# EAGLE design SK3000v5 LOGO+VIAS (EAGLE 7.2.0)
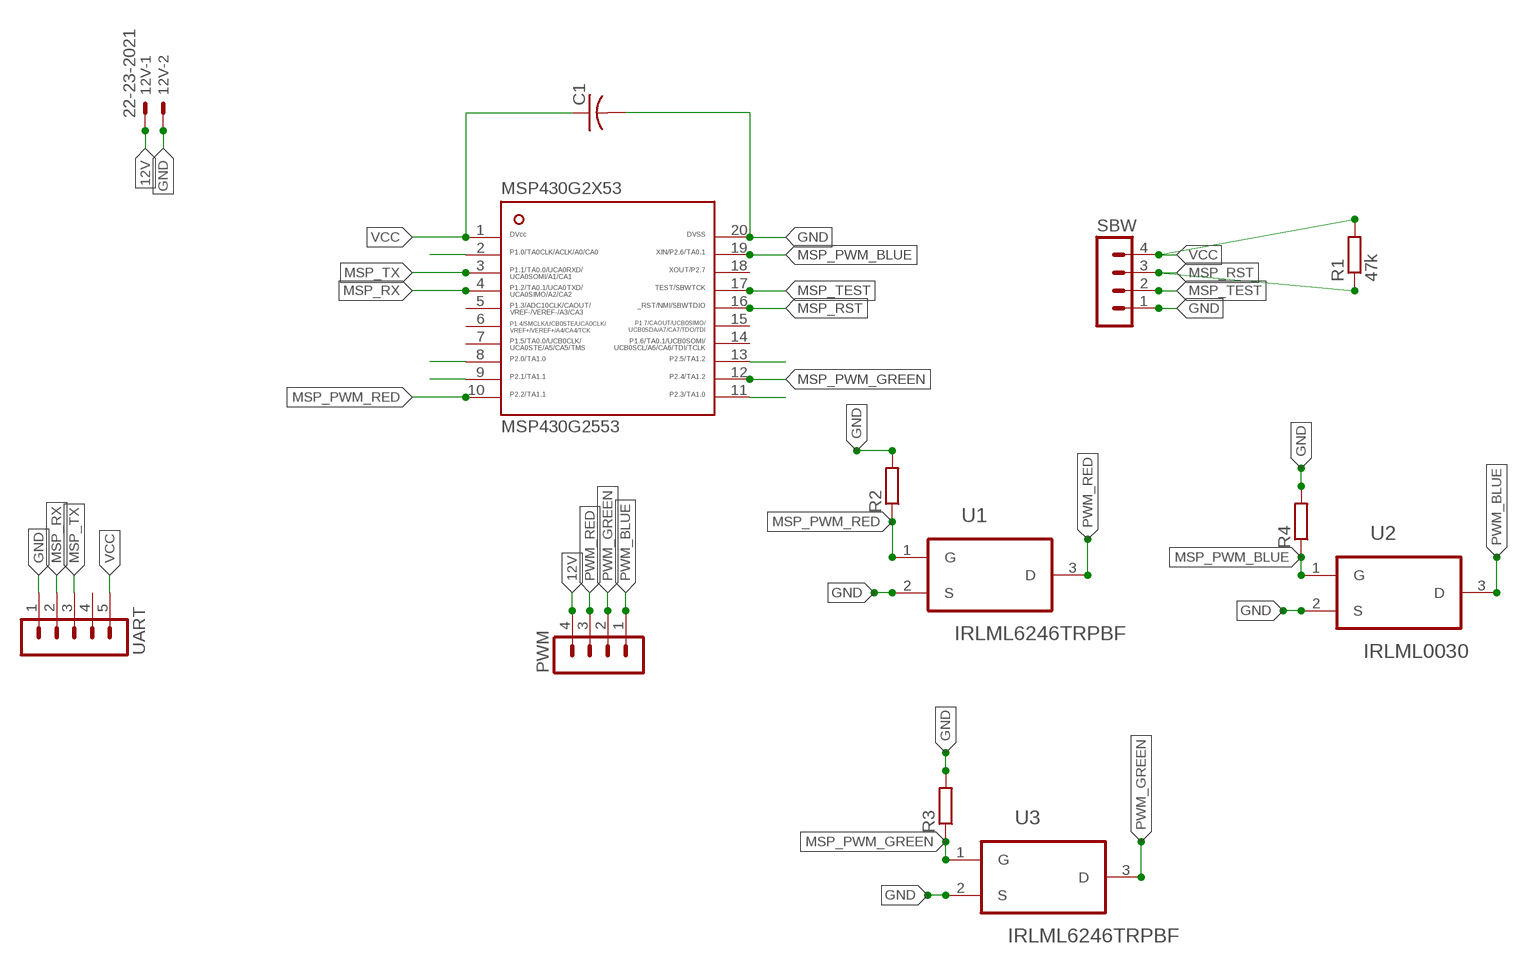
[diagram p0: schematic, sheet 1]

## Parts
12V  22-23-2021  [22-23-2021]
C1  C-USC0603  [C0603]
MSP430G2553  MSP430G2X53-20PW20  [PW20]
PWM  MA04-1  [MA04-1]
R1  47k  R-EU_R0603  [R0603]
R2  R-EU_R0603  [R0603]
R3  R-EU_R0603  [R0603]
R4  R-EU_R0603  [R0603]
SBW  MA04-1  [MA04-1]
U1  IRLML6246TRPBF  [SOT95P240X112-3N]
U2  IRLML0030  IRLML6246TRPBF  [SOT95P240X112-3N]
U3  IRLML6246TRPBF  [SOT95P240X112-3N]
UART  MA05-1  [MA05-1]

## Nets
12V: 12V.1 PWM.4
GND: 12V.2 C1.2 MSP430G2553.20 R2.2 R3.2 R4.2 SBW.1 U1.2(S) U2.2(S) U3.2(S) UART.1
MSP_PWM_BLUE: MSP430G2553.19 R4.1 U2.1(G)
MSP_PWM_GREEN: MSP430G2553.12 R3.1 U3.1(G)
MSP_PWM_RED: MSP430G2553.10 R2.1 U1.1(G)
MSP_RST: MSP430G2553.16 R1.1 SBW.3
MSP_RX: MSP430G2553.4 UART.2
MSP_TEST: MSP430G2553.17 SBW.2
MSP_TX: MSP430G2553.3 UART.3
N$32: MSP430G2553.2
N$33: MSP430G2553.8
N$34: MSP430G2553.9
N$36: MSP430G2553.13
N$37: MSP430G2553.11
PWM_BLUE: PWM.1 U2.3(D)
PWM_GREEN: PWM.2 U3.3(D)
PWM_RED: PWM.3 U1.3(D)
VCC: C1.1 MSP430G2553.1 R1.2 SBW.4 UART.5
Unconnected: MSP430G2553.5 MSP430G2553.6 MSP430G2553.7 MSP430G2553.14 MSP430G2553.15 MSP430G2553.18 UART.4

## Library data of the parts
12V = con-molex:22-23-2021: .100" (2.54mm) Center Header - 2 Pin; MF: MOLEX; MPN: 22-23-2021; OC_FARNELL: 1462926; OC_NEWARK: 25C3832
C1 = adafruit:C-US: CAPACITOR, American symbol
MSP430G2553 = ti_msp430:MSP430G2X53-20
PWM SBW = con-lstb:MA04-1: PIN HEADER; OC_FARNELL: unknown; OC_NEWARK: unknown
R1-R4 = rcl:R-EU_: RESISTOR, European symbol
U1-U3 = International_Rectifier_By_element14_Batch_1:IRLML6246TRPBF: Power MOSFET; MPN: IRLML6246TRPBF; OC_FARNELL: 1857343; OC_NEWARK: 84R9707; PACKAGE: SOT-23-3; SUPPLIER: INTERNATIONAL RECTIFIER
UART = con-lstb:MA05-1: PIN HEADER; OC_FARNELL: unknown; OC_NEWARK: unknown

## Board
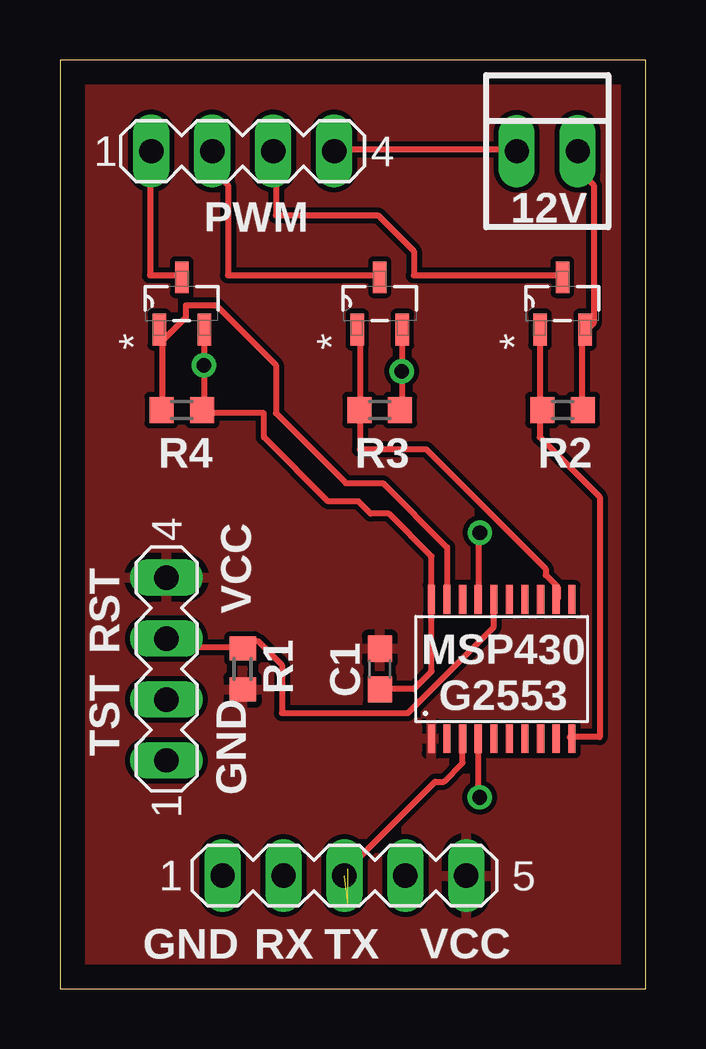
[diagram p1: board, top side]
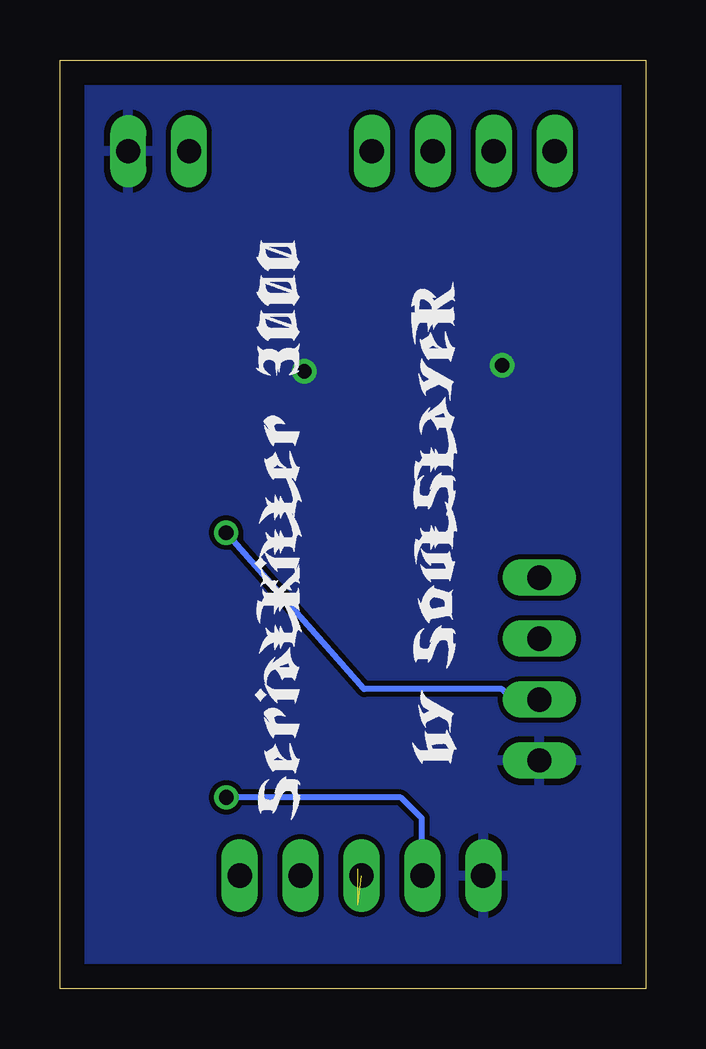
[diagram p2: board, bottom side, seen from below]

Size 24.43 x 38.73 mm. Coordinates in mm from the lower left corner, seen from the top.
Outline: 0,0 24.43,0 24.43,38.73 0,38.73 0,0
Copper layers (1*16): Top 0.035mm / dielectric 1.5mm / Bottom 0.035mm
Design rules "default": minimum track width 10mil, minimum drill 24mil, track to track 8mil, track to pad 8mil, pad to pad 8mil, via to via 8mil, smd to smd 8mil, copper to edge 40mil, drill to drill 8mil, minimum pad ring 10mil, minimum via ring 8mil, stop-mask expansion 4mil, vias tented up to drill 0mil, thermal gap 10mil

### Footprints (pad centres in the part's own frame; a part is rotated, then mirrored left to right if it is on the bottom)
22-23-2021 = drill 1 long: 1 -1.27,0; 2 1.27,0
C0603 = smd 1.1 x 1: 1 -0.85,0; 2 0.85,0
PW20 = smd 0.3 x 1.2: 1 -2.925,-2.9; 2 -2.275,-2.9; 3 -1.625,-2.9; 4 -0.975,-2.9; 5 -0.325,-2.9; 6 0.325,-2.9; 7 0.975,-2.9; 8 1.625,-2.9; 9 2.275,-2.9; 10 2.925,-2.9; 11 2.925,2.9; 12 2.275,2.9; 13 1.625,2.9; 14 0.975,2.9; 15 0.325,2.9; 16 -0.325,2.9; 17 -0.975,2.9; 18 -1.625,2.9; 19 -2.275,2.9; 20 -2.925,2.9
MA04-1 = drill 1.016 long: 1 -3.81,0; 2 -1.27,0; 3 1.27,0; 4 3.81,0
R0603 = smd 1 x 1.1: 1 -0.85,0; 2 0.85,0
SOT95P240X112-3N = smd 1.321 x 0.559: 1 -1.092,0.94; 2 -1.092,-0.94; 3 1.092,0
MA05-1 = drill 1.016 long: 1 -5.08,0; 2 -2.54,0; 3 0,0; 4 2.54,0; 5 5.08,0

### Placement (x,y rotation side)
12V  20.32,34.92 0 top
C1  13.34,13.34 270 top
MSP430G2553  18.41,13.34 0 top
PWM  7.62,34.92 0 top
R1  7.62,13.34 270 top
R2  20.95,24.13 0 top
R3  13.34,24.13 0 top
R4  5.08,24.13 0 top
SBW  4.45,13.34 90 top
U1  20.95,28.57 90 top
U2  5.08,28.57 90 top
U3  13.34,28.57 90 top
UART  11.86,4.72 0 top

### Tracks (layer width: path | path; a pad name or v marks a point on that pad's centre or on a via)
12V
  Top 0.254: 12V.1 19,35 11.5,35 PWM.4
GND  (via drill 0.61)
  Top 0.254: R2.2 21.75,24.25 21.75,27.25 U1.2 22,27.5 22.25,27.75 22.25,33.5 21.75,34 21.75,34.75 12V.2 | R3.2 14.25,24.25 v14.25,25.75 14.25,27.25 U3.2 | U2.2 6,27.25 v6,26 6,24.25 R4.2 6,24 8.5,24 8.5,23 11.18,20.32 12.45,20.32 12.95,19.81 13.72,19.81 15.49,18.03 MSP430G2553.20 | 15.5,15.75 15.5,16 MSP430G2553.20 | C1.2 13.5,12.5 14.75,12.5 15.49,13.24 MSP430G2553.20
  pour Bottom: 0.25,38.61 0.25,0 24.64,0 24.64,38.61 0.51,38.61
MSP_PWM_BLUE
  Top 0.254: 4.25,27 4.25,27.25 U2.1 4.25,27 | 4.25,27 4.25,24.25 R4.1 | 4.25,27 5.25,28 5.25,28.5 6.5,28.5 9,26 9,24 11.92,21.08 13.46,21.08 16.14,18.4 MSP430G2553.19
MSP_PWM_GREEN
  Top 0.254: U3.1 12.5,27.25 12.5,24.25 R3.1 12.5,24 12.5,22.5 15.25,22.5 20.25,17.5 20.25,17.25 20.75,16.75 20.75,16.25 MSP430G2553.12
MSP_PWM_RED
  Top 0.254: U1.1 20,27.25 20,24.25 R2.1 20,24 20,23 22.5,20.5 22.5,10.5 21.25,10.5 MSP430G2553.10
MSP_RST
  Top 0.254: SBW.3 4.5,14.5 4.5,14.25 7.5,14.25 R1.1 7.75,14.25 7.75,14.5 8.25,14.5 9.25,13.5 9.25,11.5 14.5,11.5 18.09,15.09 MSP430G2553.16
MSP_RX  (via drill 0.61)
  Top 0.254: v17.5,7.98 arc-90 17.44,8.04 MSP430G2553.4
  Bottom 0.254: UART.2 9.35,4.72 9.35,7.11 10.22,7.98 v17.5,7.98
MSP_TEST  (via drill 0.61)
  Top 0.254: v17.51,19.02 17.44,18.95 MSP430G2553.17
  Bottom 0.254: v17.51,19.02 11.75,12.5 6,12.5 5.75,12.25 4.5,12.25 SBW.2
MSP_TX  (2 unrouted)
  Top 0.254: 12,5 15.64,8.64 16,8.64 16.79,9.42 MSP430G2553.3
PWM_BLUE
  Top 0.254: U2.3 5,29.75 3.75,29.75 3.75,34.75 PWM.1
PWM_GREEN
  Top 0.254: U3.3 13.25,29.75 7,29.75 7,33.5 6.5,34 6.5,34.75 PWM.2
PWM_RED
  Top 0.254: U1.3 20.75,29.75 14.75,29.75 14.75,30.75 13.25,32.25 9,32.25 9,34.75 PWM.3
VCC
  pour Top: 0,38.51 0.06,38.51 0.06,-0.33 24.37,-0.33 24.37,38.65 0.27,38.65 0.27,38.71

### Text on the board
tNames: VCC | RST | MSP430 / G2553 | TST | GND | GND | RX | TX | VCC
bNames: C:/Users/SouLSLayeR/Desktop/Image1.bmp